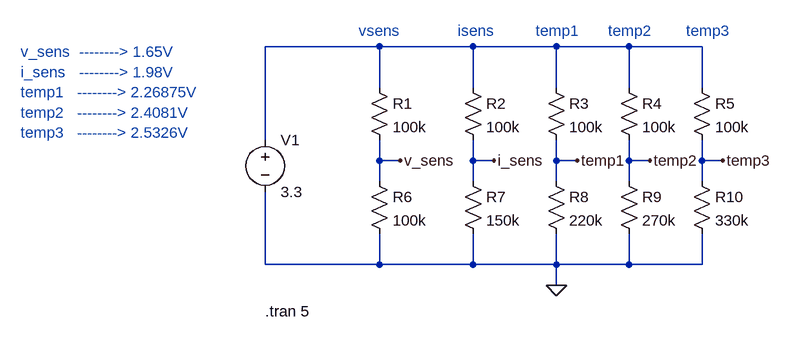
[diagram p0: schematic Draft1.asc]
Draft1.asc, the LTspice schematic file:
Version 4
SHEET 1 880 680
WIRE 192 32 16 32
WIRE 336 32 192 32
WIRE 464 32 336 32
WIRE 576 32 464 32
WIRE 688 32 576 32
WIRE 192 96 192 32
WIRE 336 96 336 32
WIRE 464 96 464 32
WIRE 576 96 576 32
WIRE 688 96 688 32
WIRE 16 176 16 32
WIRE 192 208 192 176
WIRE 224 208 192 208
WIRE 336 208 336 176
WIRE 368 208 336 208
WIRE 464 208 464 176
WIRE 496 208 464 208
WIRE 576 208 576 176
WIRE 608 208 576 208
WIRE 688 208 688 176
WIRE 720 208 688 208
WIRE 192 240 192 208
WIRE 336 240 336 208
WIRE 464 240 464 208
WIRE 576 240 576 208
WIRE 688 240 688 208
WIRE 16 368 16 256
WIRE 192 368 192 320
WIRE 192 368 16 368
WIRE 336 368 336 320
WIRE 336 368 192 368
WIRE 464 368 464 320
WIRE 464 368 336 368
WIRE 576 368 576 320
WIRE 576 368 464 368
WIRE 688 368 688 320
WIRE 688 368 576 368
WIRE 464 400 464 368
FLAG 464 400 0
FLAG 224 208 v_sens
FLAG 368 208 i_sens
FLAG 496 208 temp1
FLAG 608 208 temp2
FLAG 720 208 temp3
SYMBOL voltage 16 160 R0
WINDOW 123 0 0 Left 0
WINDOW 39 0 0 Left 0
SYMATTR InstName V1
SYMATTR Value 3.3
SYMBOL res 176 80 R0
SYMATTR InstName R1
SYMATTR Value 100k
SYMBOL res 320 80 R0
SYMATTR InstName R2
SYMATTR Value 100k
SYMBOL res 448 80 R0
SYMATTR InstName R3
SYMATTR Value 100k
SYMBOL res 560 80 R0
SYMATTR InstName R4
SYMATTR Value 100k
SYMBOL res 672 80 R0
SYMATTR InstName R5
SYMATTR Value 100k
SYMBOL res 176 224 R0
SYMATTR InstName R6
SYMATTR Value 100k
SYMBOL res 320 224 R0
SYMATTR InstName R7
SYMATTR Value 150k
SYMBOL res 448 224 R0
SYMATTR InstName R8
SYMATTR Value 220k
SYMBOL res 560 224 R0
SYMATTR InstName R9
SYMATTR Value 270k
SYMBOL res 672 224 R0
SYMATTR InstName R10
SYMATTR Value 330k
TEXT 16 440 Left 2 !.tran 5
TEXT -360 40 Left 2 ;v_sens  --------> 1.65V\ni_sens   --------> 1.98V\ntemp1   --------> 2.26875V\ntemp2   --------> 2.4081V\ntemp3   --------> 2.5326V
TEXT 160 8 Left 2 ;vsens
TEXT 312 8 Left 2 ;isens
TEXT 432 8 Left 2 ;temp1
TEXT 544 8 Left 2 ;temp2
TEXT 664 8 Left 2 ;temp3

The netlist it stands for:
* Draft1.asc
V1 N001 0 3.3
R1 N001 v_sens 100k
R2 N001 i_sens 100k
R3 N001 temp1 100k
R4 N001 temp2 100k
R5 N001 temp3 100k
R6 v_sens 0 100k
R7 i_sens 0 150k
R8 temp1 0 220k
R9 temp2 0 270k
R10 temp3 0 330k
.tran 5
* v_sens  --------> 1.65V
* i_sens   --------> 1.98V
* temp1   --------> 2.26875V
* temp2   --------> 2.4081V
* temp3   --------> 2.5326V
* vsens
* isens
* temp1
* temp2
* temp3
.backanno
.end